# Altium schematic sheet MODULATOR.SchDoc
size A3; Revision: 7
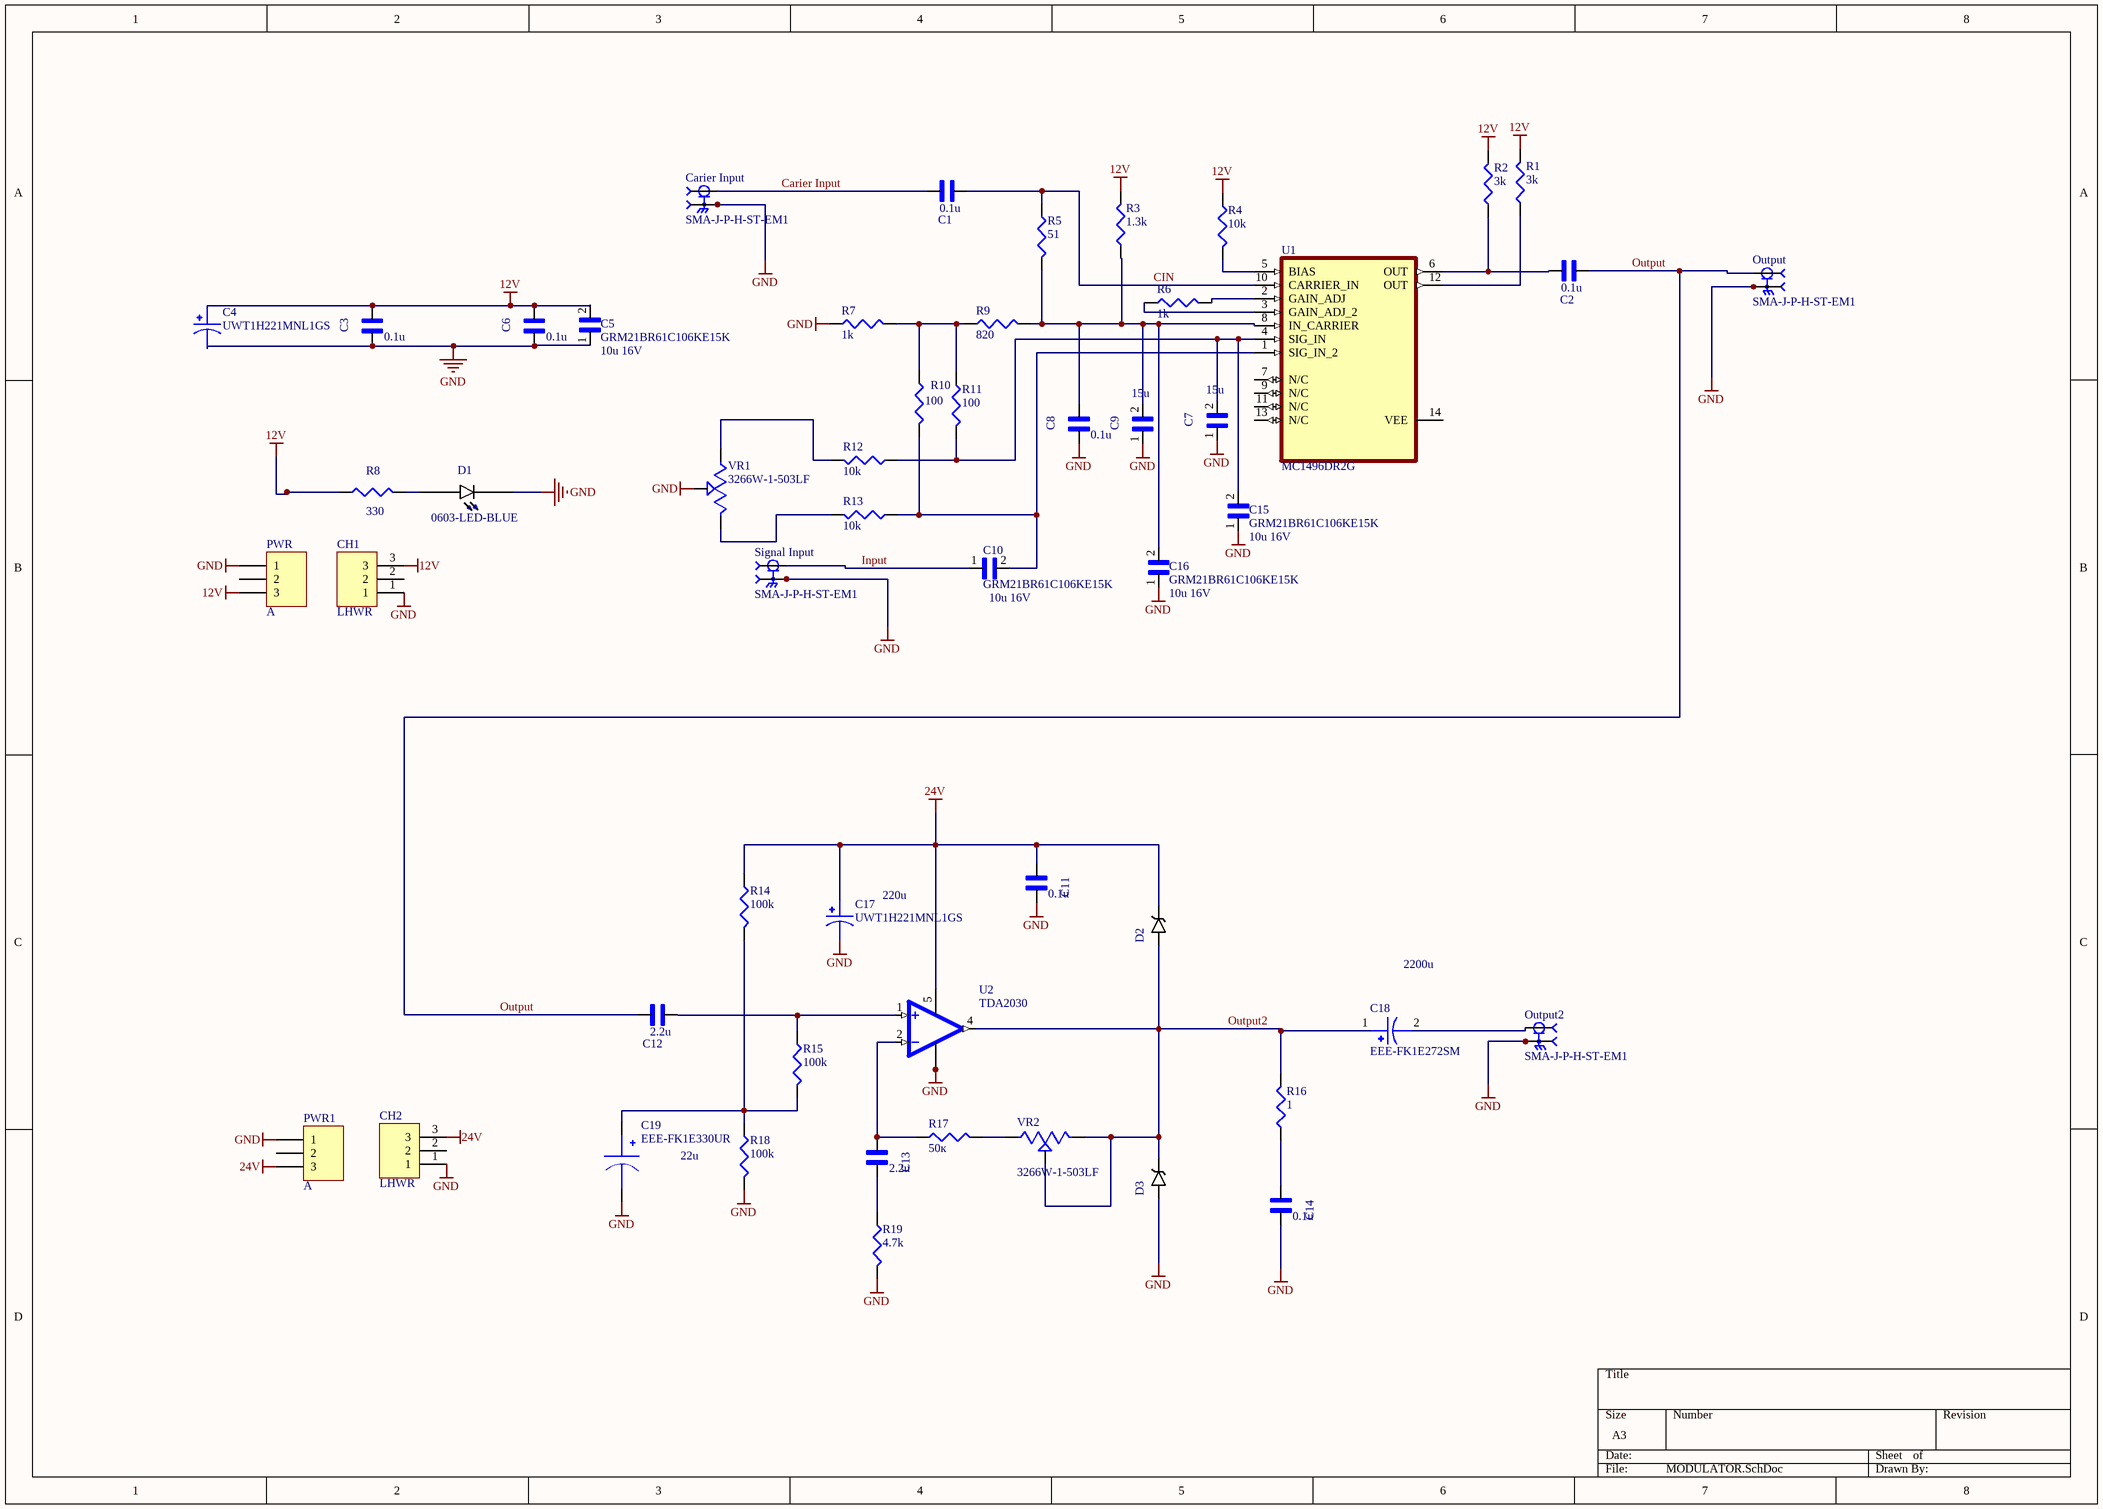
[diagram p0: MODULATOR.SchDoc]

## Parts
C1  value 0.1u  [*CAPC1608X90]  (hidden comment: GX035C104MAT2-500)
C2  value 0.1u  [*CAPC1608X90]  (hidden comment: GX035C104MAT2-500)
C3  value 0.1u  [*CAPC1608X90]  (hidden comment: GX035C104MAT2-500)
C4  UWT1H221MNL1GS  [CAPAE1030X1080N_UWT1H221MNL1GS]
C5  GRM21BR61C106KE15K  value 10u 16V  [CAPC2012X135N]
C6  value 0.1u  [*CAPC1608X90]  (hidden comment: GX035C104MAT2-500)
C7  value 15u  [*CAPC3216X125N]  (hidden comment: GRM31CR61A476KE15L)
C8  value 0.1u  [*CAPC1608X90]  (hidden comment: GX035C104MAT2-500)
C9  value 15u  [*CAPC3216X125N]  (hidden comment: GRM31CR61A476KE15L)
C10  GRM21BR61C106KE15K  value 10u 16V  [CAPC2012X135N]
C11  value 0.1u  [*CAPC1608X90]  (hidden comment: GX035C104MAT2-500)
C12  value 2.2u  [*CAP3216X125N]  (hidden comment: GRM31CR71H225KA88L)
C13  value 2.2u  [*CAP3216X125N]  (hidden comment: GRM31CR71H225KA88L)
C14  value 0.1u  [*CAPC1608X90]  (hidden comment: GX035C104MAT2-500)
C15  GRM21BR61C106KE15K  value 10u 16V  [CAPC2012X135N]
C16  GRM21BR61C106KE15K  value 10u 16V  [CAPC2012X135N]
C17  UWT1H221MNL1GS  [CAPAE1030X1080N_UWT1H221MNL1GS]
C18  EEE-FK1E272SM  [CAP_EEE-FK1E272SM]
C19  EEE-FK1E330UR  [SM_RADIAL_C]
Carier_Input  SMA-J-P-H-ST-EM1  [SAMTEC_SMA-J-P-H-ST-EM1]
CH1  LHWR  [KF350-3p]
CH2  LHWR  [KF350-3p]
D1  0603-LED-BLUE  [*LEDM1608X80_LTE-C1906R-14(Primary)]
D2  SK56  [*SMB_P6SMB62AT3G(Primary)]  (value not drawn)
D3  SK56  [*SMB_P6SMB62AT3G(Primary)]  (value not drawn)
Output  SMA-J-P-H-ST-EM1  [SAMTEC_SMA-J-P-H-ST-EM1]
Output2  SMA-J-P-H-ST-EM1  [SAMTEC_SMA-J-P-H-ST-EM1]
PWR  A  [HDR Side 3 pin]
PWR1  A  [HDR Side 3 pin]
R1  value 3k  [J1-0603]  (hidden comment: Res3)
R2  value 3k  [J1-0603]  (hidden comment: Res3)
R3  value 1.3k  [J1-0603]  (hidden comment: Res3)
R4  value 10k  [J1-0603]  (hidden comment: RC0603FR-0710KL)
R5  value 51  [J1-0603]  (hidden comment: Res3)
R6  value 1k  [J1-0603]  (hidden comment: Res3)
R7  value 1k  [J1-0603]  (hidden comment: Res3)
R8  value 330  [J1-0603]  (hidden comment: Res3)
R9  value 820  [J1-0603]  (hidden comment: Res3)
R10  value 100  [J1-0603]  (hidden comment: Res3)
R11  value 100  [J1-0603]  (hidden comment: Res3)
R12  value 10k  [J1-0603]  (hidden comment: RC0603FR-0710KL)
R13  value 10k  [J1-0603]  (hidden comment: RC0603FR-0710KL)
R14  value 100k  [J1-0603]  (hidden comment: RC0603FR-0710KL)
R15  value 100k  [J1-0603]  (hidden comment: RC0603FR-0710KL)
R16  value 1  [J1-0603]  (hidden comment: RC0603FR-0710KL)
R17  value 50к  [J1-0603]  (hidden comment: RC0603FR-0710KL)
R18  value 100k  [J1-0603]  (hidden comment: RC0603FR-0710KL)
R19  value 4.7k  [J1-0603]  (hidden comment: RC0603FR-0710KL)
Signal_Input  SMA-J-P-H-ST-EM1  [SAMTEC_SMA-J-P-H-ST-EM1]
U1  MC1496DR2G  [SOIC127P600X175-14N]
U2  TDA2030  [TO170P1580X1040X480-5]
VR1  3266W-1-503LF  [TRIM_3266W-1-503LF]
VR2  3266W-1-503LF  [TRIM_3266W-1-503LF]

## Nets
12V: C3.1 C4.1 C5.2 C6.1 CH1.3 PWR.3 R1.2 R2.2 R3.2 R4.1 R8.1
24V: C11.2 C17.1 CH2.3 D2.C PWR1.3 R14.1 U2.5(+VS)
GND: C3.2 C4.2 C5.1 C6.2 C7.1 C8.2 C9.1 C11.1 C14.1 C15.1 C16.1 C17.2 C19.2(NEG) Carier_Input.2_1 Carier_Input.2_2 Carier_Input.3_1 Carier_Input.3_2 CH1.1 CH2.1 D1.C D3.A Output.2_1 Output.2_2 Output.3_1 Output.3_2 Output2.2_1 Output2.2_2 Output2.3_1 Output2.3_2 PWR.1 PWR1.1 R7.1 R18.2 R19.2 Signal_Input.2_1 Signal_Input.2_2 Signal_Input.3_1 Signal_Input.3_2 U2.3(-VS) U2.6(-VS) U2.6.1(-VS) VR1.2(WIPER)
Carier Input: C1.1 Carier_Input.1
CIN: C1.2 R5.1 U1.10(CARRIER_IN)
Input: C10.1 Signal_Input.1
Output: C2.2 C12.1 Output.1
Output2: C18.1 D2.A D3.C R16.2 U2.4(OUTPUT) VR2.2(WIPER) VR2.3(CW)
NetC2_1: C2.1 R2.1 U1.6(OUT)
NetC7_2: C7.2 C15.2 R11.2 R12.1 U1.4(SIG_IN)
NetC8_1: C8.1 C9.2 C16.2 R3.1 R5.2 R9.2 U1.8(IN_CARRIER)
NetC10_2: C10.2 R10.2 R13.1 U1.1(SIG_IN_2)
NetC12_2: C12.2 R15.1 U2.1(NON_INV_INPUT)
NetC13_1: C13.1 R19.1
NetC13_2: C13.2 R17.1 U2.2(INV_INPUT)
NetC14_2: C14.2 R16.1
NetC18_2: C18.2 Output2.1
NetC19_1: C19.1(POS) R14.2 R15.2 R18.1
NetD1_A: D1.A R8.2
NetR1_1: R1.1 U1.12(OUT)
NetR4_2: R4.2 U1.5(BIAS)
NetR6_1: R6.1 U1.3(GAIN_ADJ_2)
NetR6_2: R6.2 U1.2(GAIN_ADJ)
NetR7_2: R7.2 R9.1 R10.1 R11.1
NetR12_2: R12.2 VR1.1(CCW)
NetR13_2: R13.2 VR1.3(CW)
NetR17_2: R17.2 VR2.1(CCW)

Not connected (* = marked no-connect by the designer): CH1 2; CH2 2; PWR 2; PWR1 2; U1 7(N/C) 9(N/C) 11(N/C) 13(N/C) 14(VEE)

## Notes on the sheet
- (near C17) 220u
- 2200u
- 22u

## Library data of the parts
C1 C2 C8 C11 C14 = GX035C104MAT2-500: Cap Thin Film 0.1uf 50v 0603; MF: AVX; Pacage Metric: 1608; Type: SMD; Package: 0603 AVX; MP: GX035C104MAT2-500; SnapEDA_Link: https://www.snapeda.com/parts/GX035C104MAT2-500/AVX/view-part/?ref=snap
C3 C6 = GX035C104MAT2-500: Cap Thin Film 0.1uf 50v 0603; MF: AVX; MP: GX035C104MAT2-500 or CL10B104JB8NNNC; Pacage Metric: 1608; Type: SMD; Package: 0603 AVX; SnapEDA_Link: https://www.snapeda.com/parts/GX035C104MAT2-500/AVX/view-part/?ref=snap
C4 C17 = UWT1H221MNL1GS: 220ВµF 50V Aluminum Electrolytic Capacitors Radial, Can - SMD 5000 Hrs @ 105В°C; MF: {'manufacturer': u'Nichicon'}; Value: *; Price: None; Availability: Unavailable; Package: None; MP: UWT1H221MNL1GS
C5 C10 C15 C16 = GRM21BR61C106KE15K: MF: {'manufacturer': u'Murata'}; Price: None; Availability: Unavailable; MP: GRM21BR61C106KE15K; Package: None
C7 C9 = GRM31CR61A476KE15L: Multilayer Ceramic Capacitor, GRM Series, 47 - F, - 10%, X5R, 10 V, 1206 [3216 Metric]; MF: Murata Electronics; Type: SMD; Package: 1206 Murata Electronics; MP: GRM31CR61A476KE15L; SnapEDA_Link: https://www.snapeda.com/parts/GRM31CR61A476KE15L/Murata%20Electronics%20North%20America/view-part/?ref=snap
C12 C13 = GRM31CR71H225KA88L: / 1206 2.2 uF 50 V В±10% Tolerance X7R SMT Multilayer Ceramic Capacitor /; MF: Murata Electronics; Type: SMD; Package: 1206 Murata; SnapEDA_Link: https://www.snapeda.com/parts/GRM31CR71H225KA88L/Murata%20Electronics%20North%20America/view-part/?ref=snap; MP: GRM31CR71H225KA88L
C18 = EEE-FK1E272SM: CAP ALUM 2700UF 20% 25V SMD; MF: {'manufacturer': u'Panasonic Electronic Components'}; Value: *; Price: None; Availability: Unavailable; Package: None; MP: EEE-FK1E272SM
C19 = EEE-FK1E330UR: MF: {'manufacturer': u'Panasonic Electronic'}; Value: *; Price: None; Availability: Unavailable; Package: None; MP: EEE-FK1E330UR
Carier_Input Output Output2 Signal_Input = SMA-J-P-H-ST-EM1: SMA Connector Jack, Female Socket 50Ohm Board Edge, End Launch Solder; MF: Samtec; SnapEDA_Link: https://www.snapeda.com/parts/SMA-J-P-H-ST-EM1/Samtec%20Inc./view-part/134500/?ref=snap; MP: SMA-J-P-H-ST-EM1; Toby_UK-Purchase-URL: https://snapeda.com/shop?store=Toby+UK&id=134500; Value: *; Package: None; Digi-Key_Part_Number: SAM8857-ND
CH1 CH2 = Connector 3Pin: Designer:: Hamed Jafarzadeh - www.R2T.ir; System: Connector
D1 = LTE-C1906R-14: LED IrLED Chip LED 2-Pin SMD T/R; Package: 0603 Lite-On; MP: 0603-LED-BLUE; SnapEDA_Link: https://www.snapeda.com/parts/LTE-C1906R-14/Lite-On%20Inc./view-part/?ref=snap; Value: *; Type: SMD
D2 D3 = SK56: Диод Шоттки 5А 60В [SMB / DO-214AA]; MF: Littelfuse Inc.; Type: SMD; MP: SK56; Package: DO-214 Littelfuse; SnapEDA_Link: https://www.snapeda.com/parts/P6SMB62AT3G/Littelfuse%20Inc./view-part/?ref=snap; Value: *; ChipDip_Link: https://www.chipdip.ru/product/sk56
PWR PWR1 = Header 3: Header, 4-Pin; System: Connector; MF: Connfly electronic (Zhenqin); MP: PLS-3 (DS1021-1x3); Type: SMD; ChipDip_Link: https://www.chipdip.ru/product/pls-3; HelpURL: https://static.chipdip.ru/lib/227/DOC000227157.pdf
R1-R3 R5-R11 = Res3: Resistor; Pacage Metric: 1608; MP: RC0603FR-07330RL; ChipDip_Link: https://www.chipdip.ru/product0/9000079628; HelpURL: https://www.chipdip.ru/product0/9000079628; Package: R0603; Type: SMD
R4 R12-R19 = RC0603FR-0710KL: 10 kOhms 1 0.1 W 1 10 W Chip Resistor 0603 1608 Metric Thick Film; Pacage Metric: 1608; MF: Yageo or NXP; MP: 10K 1% 0603; ChipDip_Link: https://www.chipdip.ru/product0/9000079736; HelpURL: https://www.chipdip.ru/product0/9000079736; Package: R0603; Type: SMD; SnapEDA_Link: https://www.snapeda.com/parts/RC0603FR-0710KL/Yageo/view-part/?ref=dk&t=RC0603FR-0710KL&con_ref=None
U1 = MC1496DR2G: MF: {'manufacturer': u'ON Semiconductor'}; Price: None; Value: *; Availability: Unavailable; MP: MC1496DR2G; Package: None
U2 = TDA2030: 14 W hi-fi audio amplifier; MF: {'manufacturer': u'STMicroelectronics'}; Price: None; MP: TDA2030; Package: None; Availability: Unavailable; Value: *
VR1 VR2 = 3266W-1-503LF: Res Cermet Trimmer 1K Ohm 10% 1/4W 12(Elec)Turn 1.78mm (6.71 X 4.5 X 8.26mm) Pin Thru-Hole Tube; MF: {'manufacturer': u'Bourns'}; Price: None; MP: 3266W-1-503LF; Package: None; Availability: Unavailable; Value: *